# EAGLE design 6309 CPU Card v0 (EAGLE 4.16)
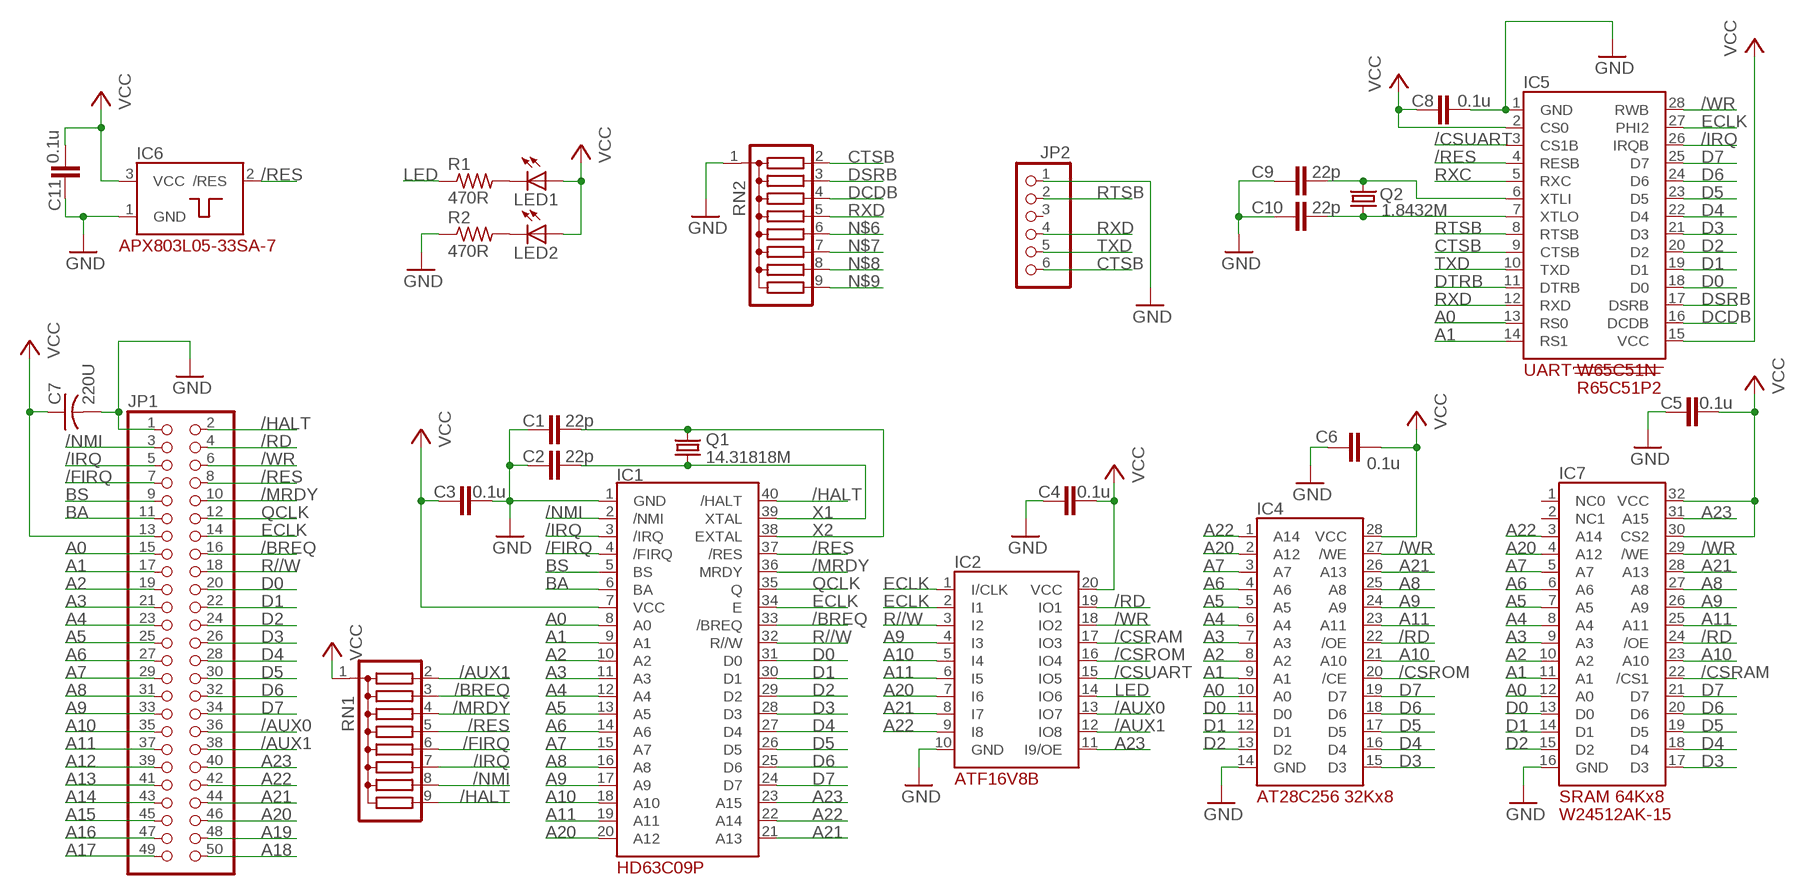
[diagram p0: schematic, sheet 1]

## Parts
C1  22p  C-EUC0603  [C0603]
C2  22p  C-EUC0603  [C0603]
C3  0.1u  C-EUC0603  [C0603]
C4  0.1u  C-EUC0603  [C0603]
C5  0.1u  C-EUC0603  [C0603]
C6  0.1u  C-EUC0603  [C0603]
C7  220U  C-US025-050X050  [C025-050X050]
C8  0.1u  C-EUC0603  [C0603]
C9  22p  C-EUC0603  [C0603]
C10  22p  C-EUC0603  [C0603]
C11  0.1u  C-EUC0603  [C0603]
IC1  HD63C09P  [DIL40]
IC2  PLD_ATF16V8B  [DIL20]
IC4  EEP_32KX8_AT28C256  [DIL28-6]
IC5  UART_W65C51N  [DIL28-6]
IC6  POR_APX803L05-33SA-7  [SOT23]
IC7  SRAM_64KX8_W24512AK-15  [DIL32-3]
JP1  PINHD-2X25  [2X25]
JP2  PINHD-1X6  [1X06]
LED1  LED3MM  [LED3MM]
LED2  LED3MM  [LED3MM]
Q1  14.31818M  CRYSTALHC49S  [HC49/S]
Q2  1.8432M  CRYSTALHC49U-H  [HC49U-H]
R1  470R  R-US_R0603  [R0603]
R2  470R  R-US_R0603  [R0603]
RN1  G08R  [SIL9]
RN2  G08R  [SIL9]

## Nets
/AUX0: IC2.13(IO7) JP1.36
/AUX1: IC2.12(IO8) JP1.38 RN1.2
/BREQ: IC1.33(/BREQ) JP1.16 RN1.3
/CSRAM: IC2.17(IO3) IC7.22(/CS1)
/CSROM: IC2.16(IO4) IC4.20(/CE)
/CSUART: IC2.15(IO5) IC5.3(CS1B)
/FIRQ: IC1.4(/FIRQ) JP1.7 RN1.6
/HALT: IC1.40(/HALT) JP1.2 RN1.9
/IRQ: IC1.3(/IRQ) IC5.26(IRQB) JP1.5 RN1.7
/MRDY: IC1.36(MRDY) JP1.10 RN1.4
/NMI: IC1.2(/NMI) JP1.3 RN1.8
/RD: IC2.19(IO1) IC4.22(/OE) IC7.24(/OE) JP1.4
/RES: IC1.37(/RES) IC5.4(RESB) IC6.2(/RES) JP1.8 RN1.5
/WR: IC2.18(IO2) IC4.27(/WE) IC5.28(RWB) IC7.29(/WE) JP1.6
A0: IC1.8(A0) IC4.10(A0) IC5.13(RS0) IC7.12(A0) JP1.15
A1: IC1.9(A1) IC4.9(A1) IC5.14(RS1) IC7.11(A1) JP1.17
A2: IC1.10(A2) IC4.8(A2) IC7.10(A2) JP1.19
A3: IC1.11(A3) IC4.7(A3) IC7.9(A3) JP1.21
A4: IC1.12(A4) IC4.6(A4) IC7.8(A4) JP1.23
A5: IC1.13(A5) IC4.5(A5) IC7.7(A5) JP1.25
A6: IC1.14(A6) IC4.4(A6) IC7.6(A6) JP1.27
A7: IC1.15(A7) IC4.3(A7) IC7.5(A7) JP1.29
A8: IC1.16(A8) IC4.25(A8) IC7.27(A8) JP1.31
A9: IC1.17(A9) IC2.4(I3) IC4.24(A9) IC7.26(A9) JP1.33
A10: IC1.18(A10) IC2.5(I4) IC4.21(A10) IC7.23(A10) JP1.35
A11: IC1.19(A11) IC2.6(I5) IC4.23(A11) IC7.25(A11) JP1.37
A12: JP1.39
A13: JP1.41
A14: JP1.43
A15: JP1.45
A16: JP1.47
A17: JP1.49
A18: JP1.50
A19: JP1.48
A20: IC1.20(A12) IC2.7(I6) IC4.2(A12) IC7.4(A12) JP1.46
A21: IC1.21(A13) IC2.8(I7) IC4.26(A13) IC7.28(A13) JP1.44
A22: IC1.22(A14) IC2.9(I8) IC4.1(A14) IC7.3(A14) JP1.42
A23: IC1.23(A15) IC2.11(I9/OE) IC7.31(A15) JP1.40
BA: IC1.6(BA) JP1.11
BS: IC1.5(BS) JP1.9
CTSB: IC5.9(CTSB) JP2.6 RN2.2
D0: IC1.31(D0) IC4.11(D0) IC5.18(D0) IC7.13(D0) JP1.20
D1: IC1.30(D1) IC4.12(D1) IC5.19(D1) IC7.14(D1) JP1.22
D2: IC1.29(D2) IC4.13(D2) IC5.20(D2) IC7.15(D2) JP1.24
D3: IC1.28(D3) IC4.15(D3) IC5.21(D3) IC7.17(D3) JP1.26
D4: IC1.27(D4) IC4.16(D4) IC5.22(D4) IC7.18(D4) JP1.28
D5: IC1.26(D5) IC4.17(D5) IC5.23(D5) IC7.19(D5) JP1.30
D6: IC1.25(D6) IC4.18(D6) IC5.24(D6) IC7.20(D6) JP1.32
D7: IC1.24(D7) IC4.19(D7) IC5.25(D7) IC7.21(D7) JP1.34
DCDB: IC5.16(DCDB) RN2.4
DSRB: IC5.17(DSRB) RN2.3
DTRB: IC5.11(DTRB)
ECLK: IC1.34(E) IC2.1(I/CLK) IC2.2(I1) IC5.27(PHI2) JP1.14
GND [supply]: C1.1 C2.1 C3.2 C4.1 C5.1 C6.1 C7.2 C8.2 C9.1 C10.1 C11.2 IC1.1(GND) IC2.10(GND) IC4.14(GND) IC5.1(GND) IC6.1(GND) IC7.16(GND) JP1.1 JP2.1 R2.1 RN2.1
LED: IC2.14(IO6) R1.1
N$1: LED1.K(C) R1.2
N$2: LED2.K(C) R2.2
N$6: RN2.6
N$7: RN2.7
N$8: RN2.8
N$9: RN2.9
N$20: C9.2 IC5.6(XTLI) Q2.2
N$21: C10.2 IC5.7(XTLO) Q2.1
QCLK: IC1.35(Q) JP1.12
R//W: IC1.32(R//W) IC2.3(I2) JP1.18
RTSB: IC5.8(RTSB) JP2.2
RXC: IC5.5(RXC)
RXD: IC5.12(RXD) JP2.4 RN2.5
TXD: IC5.10(TXD) JP2.5
VCC [supply]: C3.1 C4.2 C5.2 C6.2 C7.1 C8.1 C11.1 IC1.7(VCC) IC2.20(VCC) IC4.28(VCC) IC5.2(CS0) IC5.15(VCC) IC6.3(VCC) IC7.30(CS2) IC7.32(VCC) JP1.13 LED1.A LED2.A RN1.1
X1: C2.2 IC1.39(XTAL) Q1.1
X2: C1.2 IC1.38(EXTAL) Q1.2
Unconnected: IC7.1(NC0) IC7.2(NC1) JP2.3

## Notes on the sheet
- R65C51P2

## Library data of the parts
C1-C6 C8-C11 = rcl:C-EU: CAPACITOR, European symbol
C7 = rcl:C-US: CAPACITOR, American symbol
IC1 = 07-Retrocomputing:HD63C09P
IC2 = 07-Retrocomputing:PLD_ATF16V8B
IC4 = 07-Retrocomputing:EEP_32KX8_AT28C256
IC5 = 07-Retrocomputing:UART_W65C51N
IC6 = 07-Retrocomputing:POR_APX803L05-33SA-7
IC7 = 07-Retrocomputing:SRAM_64KX8_W24512AK-15
JP1 = pinhead:PINHD-2X25: PIN HEADER
JP2 = pinhead:PINHD-1X6: PIN HEADER
LED1 LED2 = led:LED: LED OSRAM: - CHIPLED LG R971, LG N971, LY N971, LG Q971, LY Q971, LO R971, LY R971 LH N974, LH R974 LS Q976, LO Q976, LY Q976 LO Q996 - Hyper CHIPLED LW Q18S LB Q993, LB Q99A, LB R99A - SideLED LS A670, LO A670, LY A670, LG A670, LP A670 LB A673, LV A673, LT A673, LW A673 LH A674 LY A675 LS A676, LA A676, LO A676, LY A676, LW A676 LS A679, LY A679, LG A679 - Hyper Micro SIDELED® LS Y876, LA Y876, LO Y876, LY Y876 LT Y87S - SmartLED LW L88C, LW L88S LB L89C, LB L89S, LG L890 LS L89K, LO L89K, LY L89K LS L896, LA L896, LO L896, LY L896 - TOPLED LS T670, LO T670, LY T670, LG T670, LP T670 LSG T670, LSP T670, LSY T670, LOP T670, LYG T670 LG T671, LOG T671, LSG T671 LB T673, LV T673, LT T673, LW T673 LH T674 LS T676, LA T676, LO T676, LY T676, LB T676, LH T676, LSB T676, LW T676 LB T67C, LV T67C, LT T67C, LS T67K, LO T67K, LY T67K, LW E67C LS E67B, LA E67B, LO E67B, LY E67B, LB E67C, LV E67C, LT E67C LW T67C LS T679, LY T679, LG T679 LS T770, LO T770, LY T770, LG T770, LP T770 LB T773, LV T773, LT T773, LW T773 LH T774 LS E675, LA E675, LY E675, LS T675 LS T776, LA T776, LO T776, LY T776, LB T776 LHGB T686 LT T68C, LB T68C - Hyper Mini TOPLED® LB M676 - Mini TOPLED Santana® LG M470 LS M47K, LO M47K, LY M47K Source: http://www.osram.convergy.de - LUMILED® LXK2-PW12-R00, LXK2-PW12-S00, LXK2-PW14-U00, LXK2-PW14-V00 LXK2-PM12-R00, LXK2-PM12-S00, LXK2-PM14-U00 LXK2-PE12-Q00, LXK2-PE12-R00, LXK2-PE12-S00, LXK2-PE14-T00, LXK2-PE14-U00 LXK2-PB12-K00, LXK2-PB12-L00, LXK2-PB12-M00, LXK2-PB14-N00, LXK2-PB14-P00, LXK2-PB14-Q00 LXK2-PR12-L00, LXK2-PR12-M00, LXK2-PR14-Q00, LXK2-PR14-R00 LXK2-PD12-Q00, LXK2-PD12-R00, LXK2-PD12-S00 LXK2-PH12-R00, LXK2-PH12-S00 LXK2-PL12-P00, LXK2-PL12-Q00, LXK2-PL12-R00 Source: www.luxeon.com
Q1 Q2 = crystal:CRYSTAL: CRYSTAL
R1 R2 = rcl:R-US_: RESISTOR, American symbol
RN1 RN2 = resistor-sil:G08R: SIL RESISTOR

## Net classes
0 default: width 0.203 mm, drill 0.203 mm, clearance 0.254 mm
1 supply: width 0.61 mm, drill 0.203 mm, clearance 0.305 mm

## Board
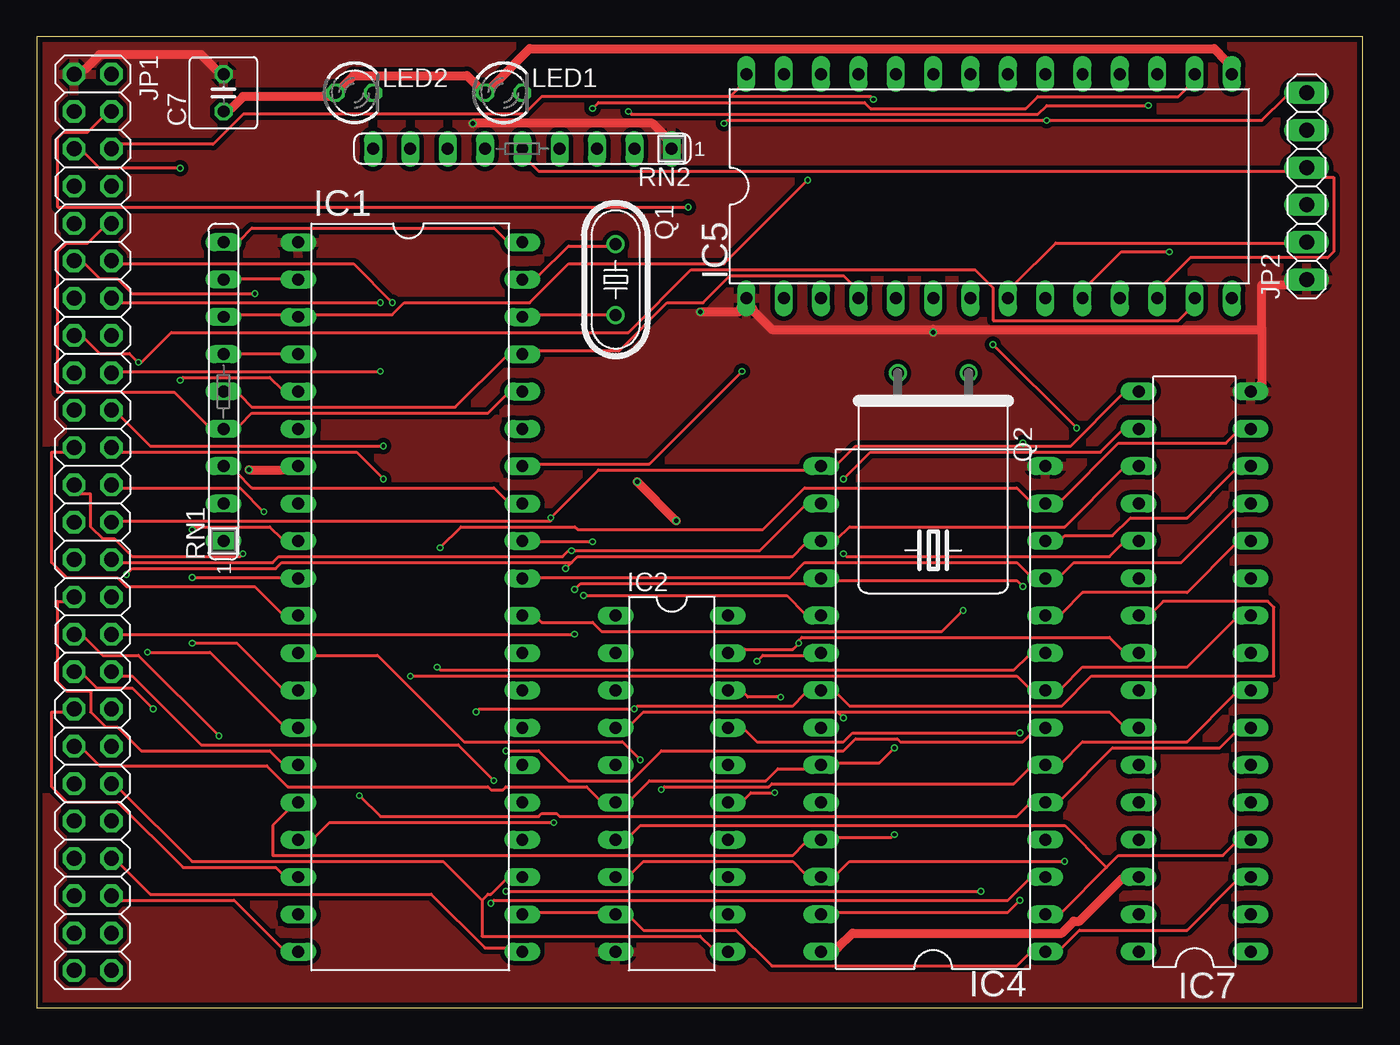
[diagram p1: board, top side]
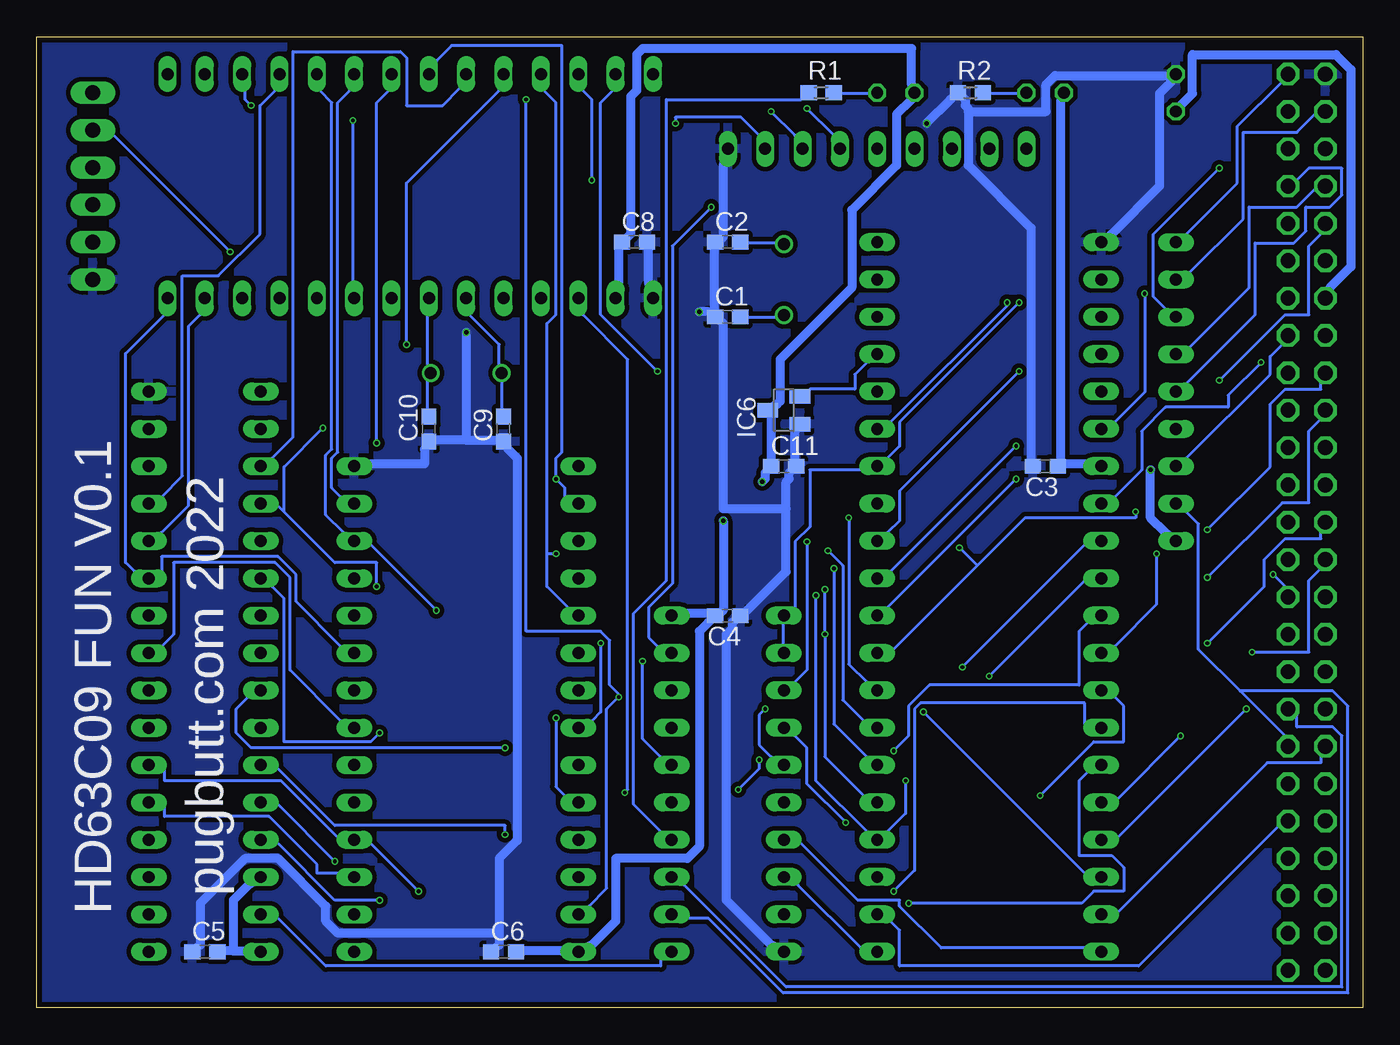
[diagram p2: board, bottom side, seen from below]

Size 90.17 x 66.04 mm. Coordinates in mm from the lower left corner, seen from the top.
Outline: 0,0 90.17,0 90.17,66.04 0,66.04 0,0
Copper layers (1*2*15*16): Top 0.0356mm / dielectric 0.1702mm / Route2 0.0178mm / dielectric 1.1938mm / Route15 0.0178mm / dielectric 0.1702mm / Bottom 0.0356mm
Design rules "oshpark-4layer": minimum track width 5mil, minimum drill 10mil, track to track 5mil, track to pad 5mil, pad to pad 5mil, via to via 5mil, smd to smd 5mil, copper to edge 15mil, drill to drill 6mil, minimum pad ring 4mil, minimum via ring 4mil, stop-mask expansion 2.5mil, vias tented up to drill 0mil, thermal gap 10mil

### Footprints (pad centres in the part's own frame; a part is rotated, then mirrored left to right if it is on the bottom)
C0603 = smd 1.1 x 1: 1 -0.85,0; 2 0.85,0
C025-050X050 = drill 0.813 octagon: 1 -1.27,0; 2 1.27,0
DIL40 = drill 0.813 long: 1 -24.13,-7.62; 2 -21.59,-7.62; 3 -19.05,-7.62; 4 -16.51,-7.62; 5 -13.97,-7.62; 6 -11.43,-7.62; 7 -8.89,-7.62; 8 -6.35,-7.62; 9 -3.81,-7.62; 10 -1.27,-7.62; 11 1.27,-7.62; 12 3.81,-7.62; 13 6.35,-7.62; 14 8.89,-7.62; 15 11.43,-7.62; 16 13.97,-7.62; 17 16.51,-7.62; 18 19.05,-7.62; 19 21.59,-7.62; 20 24.13,-7.62; 21 24.13,7.62; 22 21.59,7.62; 23 19.05,7.62; 24 16.51,7.62; 25 13.97,7.62; 26 11.43,7.62; 27 8.89,7.62; 28 6.35,7.62; 29 3.81,7.62; 30 1.27,7.62; 31 -1.27,7.62; 32 -3.81,7.62; 33 -6.35,7.62; 34 -8.89,7.62; 35 -11.43,7.62; 36 -13.97,7.62; 37 -16.51,7.62; 38 -19.05,7.62; 39 -21.59,7.62; 40 -24.13,7.62
DIL20 = drill 0.813 long: 1 -11.43,-3.81; 2 -8.89,-3.81; 3 -6.35,-3.81; 4 -3.81,-3.81; 5 -1.27,-3.81; 6 1.27,-3.81; 7 3.81,-3.81; 8 6.35,-3.81; 9 8.89,-3.81; 10 11.43,-3.81; 11 11.43,3.81; 12 8.89,3.81; 13 6.35,3.81; 14 3.81,3.81; 15 1.27,3.81; 16 -1.27,3.81; 17 -3.81,3.81; 18 -6.35,3.81; 19 -8.89,3.81; 20 -11.43,3.81
DIL28-6 = drill 0.813 long: 1 -16.51,-7.62; 2 -13.97,-7.62; 3 -11.43,-7.62; 4 -8.89,-7.62; 5 -6.35,-7.62; 6 -3.81,-7.62; 7 -1.27,-7.62; 8 1.27,-7.62; 9 3.81,-7.62; 10 6.35,-7.62; 11 8.89,-7.62; 12 11.43,-7.62; 13 13.97,-7.62; 14 16.51,-7.62; 15 16.51,7.62; 16 13.97,7.62; 17 11.43,7.62; 18 8.89,7.62; 19 6.35,7.62; 20 3.81,7.62; 21 1.27,7.62; 22 -1.27,7.62; 23 -3.81,7.62; 24 -6.35,7.62; 25 -8.89,7.62; 26 -11.43,7.62; 27 -13.97,7.62; 28 -16.51,7.62
SOT23 = smd 1 x 1.4: 1 -0.95,-1.1; 2 0.95,-1.1; 3 0,1.1
DIL32-3 = drill 0.813 long: 1 -19.05,-3.81; 2 -16.51,-3.81; 3 -13.97,-3.81; 4 -11.43,-3.81; 5 -8.89,-3.81; 6 -6.35,-3.81; 7 -3.81,-3.81; 8 -1.27,-3.81; 9 1.27,-3.81; 10 3.81,-3.81; 11 6.35,-3.81; 12 8.89,-3.81; 13 11.43,-3.81; 14 13.97,-3.81; 15 16.51,-3.81; 16 19.05,-3.81; 17 19.05,3.81; 18 16.51,3.81; 19 13.97,3.81; 20 11.43,3.81; 21 8.89,3.81; 22 6.35,3.81; 23 3.81,3.81; 24 1.27,3.81; 25 -1.27,3.81; 26 -3.81,3.81; 27 -6.35,3.81; 28 -8.89,3.81; 29 -11.43,3.81; 30 -13.97,3.81; 31 -16.51,3.81; 32 -19.05,3.81
2X25 = drill 1.016 octagon: 1 -30.48,-1.27; 2 -30.48,1.27; 3 -27.94,-1.27; 4 -27.94,1.27; 5 -25.4,-1.27; 6 -25.4,1.27; 7 -22.86,-1.27; 8 -22.86,1.27; 9 -20.32,-1.27; 10 -20.32,1.27; 11 -17.78,-1.27; 12 -17.78,1.27; 13 -15.24,-1.27; 14 -15.24,1.27; 15 -12.7,-1.27; 16 -12.7,1.27; 17 -10.16,-1.27; 18 -10.16,1.27; 19 -7.62,-1.27; 20 -7.62,1.27; 21 -5.08,-1.27; 22 -5.08,1.27; 23 -2.54,-1.27; 24 -2.54,1.27; 25 0,-1.27; 26 0,1.27; 27 2.54,-1.27; 28 2.54,1.27; 29 5.08,-1.27; 30 5.08,1.27; 31 7.62,-1.27; 32 7.62,1.27; 33 10.16,-1.27; 34 10.16,1.27; 35 12.7,-1.27; 36 12.7,1.27; 37 15.24,-1.27; 38 15.24,1.27; 39 17.78,-1.27; 40 17.78,1.27; 41 20.32,-1.27; 42 20.32,1.27; 43 22.86,-1.27; 44 22.86,1.27; 45 25.4,-1.27; 46 25.4,1.27; 47 27.94,-1.27; 48 27.94,1.27; 49 30.48,-1.27; 50 30.48,1.27
1X06 = drill 1.016 long: 1 -6.35,0; 2 -3.81,0; 3 -1.27,0; 4 1.27,0; 5 3.81,0; 6 6.35,0
LED3MM = drill 0.813 octagon: A -1.27,0; K 1.27,0
HC49/S = drill 0.813 round: 1 -2.413,0; 2 2.413,0
HC49U-H = drill 0.813 round: 1 -2.413,-5.08; 2 2.413,-5.08
R0603 = smd 1.1 x 1: 1 -0.85,0; 2 0.85,0
SIL9 = drill 0.813 long: 1 -10.16,0; 2 -7.62,0; 3 -5.08,0; 4 -2.54,0; 5 0,0; 6 2.54,0; 7 5.08,0; 8 7.62,0; 9 10.16,0

### Placement (x,y rotation side)
C1  43.18,46.99 0 bottom
C2  43.18,52.07 0 bottom
C3  21.59,36.83 180 bottom
C4  43.18,26.67 180 bottom
C5  78.74,3.81 0 bottom
C6  58.42,3.81 0 bottom
C7  12.7,62.23 90 top
C8  49.53,52.07 0 bottom
C9  58.42,39.37 90 bottom
C10  63.5,39.37 90 bottom
C11  39.37,36.83 0 bottom
IC1  25.4,27.94 270 top
IC2  43.18,15.24 270 top
IC4  60.96,20.32 90 top
IC5  64.77,55.88 0 top
IC6  39.37,40.64 90 bottom
IC7  78.74,22.86 90 top
JP1  3.81,33.02 270 top
JP2  86.36,55.88 90 top
LED1  31.75,62.23 0 top
LED2  21.59,62.23 0 top
Q1  39.37,49.53 270 top
Q2  60.96,38.1 180 top
R1  36.83,62.23 0 bottom
R2  26.67,62.23 0 bottom
RN1  12.7,41.91 90 top
RN2  33.02,58.42 180 top

### Tracks (layer width: path | path; a pad name or v marks a point on that pad's centre or on a via)
/AUX0
  Bottom 0.203: IC2.13 46.13,8.33 39.22,1.42 1.42,1.42 1.42,18.49 2.03,19.1 4.47,19.1 4.47,19.91 JP1.36
/AUX1
  Bottom 0.203: 8.33,21.54 5.28,18.49 JP1.38 | 8.33,21.54 11.18,24.38 11.18,32.92 11.99,33.73 RN1.2 | 8.33,21.54 2.03,21.54 1.02,20.52 1.02,1.02 39.42,1.02 44.5,6.1 45.92,6.1 IC2.12
/BREQ
  Top 0.203: IC1.33 31.9,34.54 31.09,35.36 14.63,35.36 13.61,36.37 RN1.3
  Bottom 0.203: RN1.3 11.99,37.39 6.3,43.08 6.3,44.3 5.49,45.11 JP1.16
/CSRAM  (via drill 0.25)
  Top 0.203: v66.85,18.69 55.47,18.69 54.86,18.09 48.97,18.09 48.16,18.9 IC2.17
  Bottom 0.203: v66.85,18.69 67.46,18.09 73.36,18.09 73.36,27.84 74.17,28.65 IC7.22
/CSROM  (via drill 0.25)
  Top 0.203: v48.97,23.57 49.38,23.98 52.22,23.98 IC4.20
  Bottom 0.203: v48.97,23.57 48.97,18.29 47.75,17.07 IC2.16
/CSUART  (via drill 0.25)
  Top 0.203: v50.19,14.63 48.56,14.63 48.16,14.22 IC2.15
  Bottom 0.203: v50.19,14.63 49.99,14.83 49.99,44.09 53.03,47.14 IC5.3
/FIRQ
  Top 0.203: RN1.6 13.82,44.5 16.66,44.5 IC1.4
  Bottom 0.203: JP1.7 3.25,55.68 4.47,54.46 7.72,54.46 7.72,48.97 11.79,44.91 RN1.6
/HALT
  Top 0.203: IC1.40 31.9,52.22 31.09,53.03 14.63,53.03 13.82,52.22 RN1.9
  Bottom 0.203: RN1.9 11.99,52.63 8.53,56.08 8.53,59.94 5.49,62.99 JP1.2
/IRQ  (via drill 0.25)
  Top 0.203: RN1.7 13.82,47.14 16.66,47.14 IC1.3 18.9,47.14 24.18,47.14 24.99,47.95 33.53,47.95 36.17,50.6 46.74,50.6 v52.43,56.29 | v9.75,57.1 4.27,57.1 3.25,58.12 JP1.5
  Bottom 0.203: v52.43,56.29 52.43,61.77 53.03,62.38 IC5.26 | v9.75,57.1 14.22,52.63 14.22,48.36 13.41,47.55 RN1.7
/MRDY
  Top 0.203: IC1.36 31.9,41.66 30.68,40.44 14.63,40.44 13.82,39.62 RN1.4 11.58,39.62 9.35,41.86 1.42,41.86 1.42,51.41 2.03,52.02 3.45,52.02 4.47,53.03 JP1.10
/NMI
  Top 0.203: RN1.8 13.82,49.58 16.66,49.58 IC1.2
  Bottom 0.203: JP1.3 3.25,60.76 4.47,59.54 8.13,59.54 8.13,53.65 11.79,49.99 RN1.8
/RD  (via drill 0.25)
  Top 0.203: IC2.19 48.16,24.38 51.41,24.38 v51.82,24.79 51.82,24.99 52.02,25.2 72.95,25.2 73.76,24.38 IC7.24 | v44.3,54.46 1.42,54.46 1.42,59.13 1.83,59.54 3.45,59.54 4.47,60.55 JP1.4
  Bottom 0.203: v51.82,24.79 51.82,20.12 52.43,19.51 IC4.22 | v44.3,54.46 46.94,51.82 46.94,28.85 48.56,27.23 48.56,25.2 47.95,24.59 IC2.19
/RES
  Top 0.203: RN1.5 13.82,41.66 14.63,40.84 28.45,40.84 31.9,44.3 IC1.37 34.14,44.7 39.62,44.7 42.88,47.95 45.31,47.95 47.14,49.78 54.86,49.78 55.47,49.17 IC5.4
  Bottom 0.203: IC6.2 37.59,42.06 34.54,42.06 34.54,43.08 33.73,43.89 IC1.37 | JP1.8 4.47,56.29 3.66,57.1 1.42,57.1 1.42,55.27 2.23,54.46 3.86,54.46 3.86,52.83 4.67,52.02 7.32,52.02 7.32,47.14 11.99,42.47 RN1.5
/WR  (via drill 0.25)
  Top 0.203: v50.6,21.13 48.36,21.13 48.16,21.34 IC2.18 | v66.85,7.32 66.04,6.5 54.46,6.5 IC4.27 | 47.14,61.98 47.75,62.59 IC5.28 | 47.14,61.98 34.34,61.98 33.12,60.76 14.02,60.76 11.99,58.73 5.69,58.73 JP1.6 | v56.9,61.77 56.69,61.98 47.14,61.98
  Bottom 0.203: IC4.27 52.63,6.91 51.41,8.13 51.41,20.32 v50.6,21.13 50.6,21.34 51.21,21.95 51.21,24.99 51.82,25.6 56.9,25.6 v56.9,61.77 | v66.85,7.32 69.9,7.32 73.76,11.18 IC7.29
A0  (via drill 0.25)
  Top 0.203: JP1.15 3.25,45.52 4.27,44.5 6.3,44.5 v6.91,43.89 7.11,43.89 9.14,45.92 40.23,45.92 44.5,50.19 63.8,50.19 65.02,48.97 65.02,46.74 77.62,46.74 78.23,47.35 IC5.13 | IC4.10 69.7,26.82 71.12,28.25 78.23,28.25 81.48,31.5 IC7.12
  Bottom 0.203: v6.91,43.89 9.14,41.66 9.14,40.84 13.41,40.84 15.04,39.22 15.04,36.58 16.87,34.75 IC1.8 | IC5.13 79.05,47.14 79.86,46.33 79.86,34.14 81.69,32.31 IC7.12
A1  (via drill 0.25)
  Top 0.203: v10.57,32.51 10.77,32.72 15.85,32.72 16.66,31.9 IC1.9 | v27.23,23.16 27.43,22.96 66.45,22.96 67.46,23.98 IC4.9
  Bottom 0.203: v10.57,32.51 6.3,36.78 6.3,41.05 5.28,42.06 2.85,42.06 2.85,42.47 JP1.17 | IC4.9 69.49,24.59 72.54,27.64 72.54,29.46 73.76,30.68 81.69,30.68 81.69,29.67 IC7.11 83.52,29.67 84.12,30.28 84.12,44.5 81.48,47.14 IC5.14 | v27.23,23.16 18.9,31.5 IC1.9
A2  (via drill 0.25)
  Top 0.203: IC7.10 81.48,26.42 78.23,23.16 71.12,23.16 69.7,21.74 IC4.8 67.46,21.74 66.65,22.55 v25.4,22.55 | v10.57,29.26 16.66,29.26 IC1.10
  Bottom 0.203: v10.57,29.26 5.49,34.34 3.66,34.34 3.66,39.22 2.85,40.03 JP1.19 | v25.4,22.55 18.9,29.06 IC1.10
A3  (via drill 0.25)
  Top 0.203: IC1.11 16.66,26.82 14.83,28.65 6.1,28.65 5.49,29.26 2.03,29.26 1.02,30.28 1.02,37.8 1.83,37.8 JP1.21 | v31.9,17.48 34.14,17.48 36.17,15.44 40.44,15.44 42.47,17.48 54.86,17.48 55.68,18.29 58.52,18.29 58.73,18.09 67.06,18.09 67.67,18.69 IC4.7
  Bottom 0.203: IC4.7 69.49,19.51 72.95,22.96 72.95,29.26 73.97,30.28 80.87,30.28 80.87,25.4 81.69,24.59 IC7.9 | v31.9,17.48 30.89,18.49 30.89,20.52 29.46,21.95 19.3,21.95 19.3,25.6 18.69,26.21 IC1.11
A4  (via drill 0.25)
  Top 0.203: IC7.8 81.48,21.34 78.23,18.09 71.12,18.09 69.7,16.66 IC4.6 67.46,16.26 66.45,15.24 49.99,15.24 49.78,15.04 42.67,15.04 v42.47,14.83 | v14.02,30.89 13.82,30.68 6.5,30.68 5.28,31.9 4.47,31.9 3.66,32.72 3.66,34.95 2.85,34.95 JP1.23 | v41.05,16.87 39.83,18.09 29.06,18.09 23.16,23.98 18.9,23.98 IC1.12
  Bottom 0.203: v14.02,30.89 14.02,27.43 16.87,24.59 IC1.12 | v42.47,14.83 41.05,16.26 v41.05,16.87
A5  (via drill 0.25)
  Top 0.203: IC7.7 81.48,18.69 80.47,17.68 73.15,17.68 69.7,14.22 IC4.5 67.46,13.82 66.65,13.01 35.56,13.01 35.36,13.21 34.34,13.21 34.14,13.01 23.37,13.01 v21.95,14.43 | v10.57,24.79 13.61,24.79 16.66,21.74 IC1.13
  Bottom 0.203: v10.57,24.79 6.71,28.65 6.71,30.48 5.28,31.9 2.85,31.9 2.85,32.31 JP1.25 | v21.95,14.43 18.29,18.09 16.26,18.09 16.26,20.52 16.87,21.13 IC1.13
A6  (via drill 0.25)
  Top 0.203: v7.52,24.18 11.79,24.18 16.66,19.3 IC1.14 | v31.9,7.92 v64.21,7.92
  Bottom 0.203: IC7.6 81.48,16.26 81.48,15.44 73.56,15.44 69.7,11.58 IC4.4 67.46,11.18 v64.21,7.92 | v7.52,24.18 3.66,24.18 3.66,29.06 2.85,29.87 JP1.27 | v31.9,7.92 30.48,9.35 30.48,20.32 30.07,20.73 18.9,20.73 18.9,19.3 IC1.14
A7  (via drill 0.25)
  Top 0.203: IC1.15 16.66,16.66 15.85,17.48 7.11,17.48 5.49,19.1 4.67,19.1 3.66,20.12 3.66,21.54 2.03,21.54 1.42,22.15 1.42,27.64 1.83,27.64 JP1.29 | v30.89,7.11 31.09,7.32 66.04,7.32 67.46,8.74 IC4.3
  Bottom 0.203: IC4.3 69.7,9.14 71.12,9.14 71.12,9.75 74.37,13.01 81.48,13.01 81.48,13.61 IC7.5 | v30.89,7.11 19.1,7.11 18.29,7.92 16.26,7.92 16.26,9.55 17.07,10.36 19.3,10.36 19.3,15.44 18.69,16.05 IC1.15
A8  (via drill 0.25)
  Top 0.203: IC1.16 17.07,13.41 16.05,12.39 16.05,10.36 51.41,10.36 52.22,11.18 IC4.25 54.46,11.58 58.12,11.58 v58.32,11.79 | v12.39,18.49 6.91,23.98 4.47,23.98 3.25,25.2 JP1.31
  Bottom 0.203: v58.32,11.79 58.32,12.39 69.9,12.39 73.76,16.26 IC7.27 | v12.39,18.49 16.66,14.22 IC1.16
A9  (via drill 0.25)
  Top 0.203: v7.92,20.32 6.5,21.74 4.06,21.74 3.25,22.55 JP1.33 | 54.46,20.12 v54.86,19.71 | 54.46,20.12 41.25,20.12 40.44,19.3 IC2.4 | 54.46,20.12 72.95,20.12 73.76,19.3 IC7.26 | v35.15,12.6 19.91,12.6 18.9,11.58 IC1.17
  Bottom 0.203: v7.92,20.32 16.66,11.58 IC1.17 | v54.86,19.71 54.86,15.04 54.25,14.43 IC4.24 | v35.15,12.6 37.8,15.24 37.8,17.68 38.61,18.49 IC2.4
A10  (via drill 0.25)
  Top 0.203: IC1.18 16.66,9.14 16.26,9.55 9.96,9.55 5.49,14.02 2.03,14.02 1.02,15.04 1.02,20.12 1.83,20.12 JP1.35 | IC7.23 76,27.03 76.61,27.64 83.72,27.64 84.12,27.23 84.12,22.55 71.73,22.55 69.7,20.52 55.27,20.52 54.46,21.34 IC4.21 52.22,21.34 51.41,20.52 40.84,20.52 v40.64,20.32 30.07,20.32 v29.87,20.12
  Bottom 0.203: v40.64,20.32 41.05,19.91 41.05,17.88 40.23,17.07 IC2.5 | v29.87,20.12 18.9,9.14 IC1.18
A11  (via drill 0.25)
  Top 0.203: v58.32,17.68 57.3,16.66 54.46,16.66 IC4.23 52.22,16.26 50.39,16.26 49.58,15.44 41.66,15.44 40.44,14.22 IC2.6 38.2,14.22 37.39,15.04 31.9,15.04 31.7,14.83 30.89,14.83 30.68,15.04 17.07,15.04 15.65,16.46 4.27,16.46 3.25,17.48 JP1.37
  Bottom 0.203: IC1.19 16.66,6.5 6.5,16.66 2.85,16.66 2.85,17.07 JP1.37 | v58.32,17.68 75.59,17.68 76.61,18.69 76.61,20.32 75.79,21.13 IC7.25
A20
  Top 0.203: 72.75,9.55 73.56,10.36 80.67,10.36 81.48,11.18 IC7.4 | 72.75,9.55 69.7,6.5 IC4.2 | IC1.20 16.66,4.06 13.41,7.32 5.69,7.32 JP1.46 | 72.75,9.55 69.9,12.39 41.05,12.39 40.44,11.79 IC2.7
  Bottom 0.203: IC2.7 38.2,11.18 34.34,7.32 31.5,7.32 31.5,6.91 28.65,4.06 18.9,4.06 IC1.20
A21  (via drill 0.25)
  Top 0.203: IC2.8 40.44,9.14 41.25,9.96 51.41,9.96 52.22,9.14 IC4.26 54.46,9.14 55.27,9.96 v69.9,9.96 | JP1.44 5.69,9.75 7.72,7.72 26.82,7.72 30.48,4.06 31.9,4.06 IC1.21
  Bottom 0.203: IC1.21 34.14,4.06 38.41,8.33 38.41,8.53 IC2.8 | v69.9,9.96 73.76,13.82 IC7.28
A22
  Top 0.203: IC7.3 81.48,8.53 78.23,5.28 70.92,5.28 69.7,4.06 IC4.1 67.46,3.66 66.65,2.85 49.99,2.85 47.55,5.28 41.25,5.28 40.44,6.1 IC2.9 38.2,6.5 34.14,6.5 IC1.22
  Bottom 0.203: JP1.42 5.69,12.39 15.24,2.85 31.5,2.85 31.5,5.28 32.11,5.89 IC1.22
A23
  Top 0.203: 30.28,7.32 30.68,7.72 30.89,7.72 31.9,8.74 IC1.23 | 30.28,7.32 30.28,4.88 45.11,4.88 45.92,4.06 IC2.11 | 30.28,7.32 27.64,9.96 10.57,9.96 5.69,14.83 JP1.40
  Bottom 0.203: IC7.31 73.76,6.1 70.51,2.85 47.75,2.85 47.75,3.25 IC2.11
BA  (via drill 0.25)
  Top 0.203: v14.83,48.56 6.5,48.56 5.49,49.58 4.27,49.58 3.25,50.6 JP1.11
  Bottom 0.203: v14.83,48.56 14.83,41.86 16.87,39.83 IC1.6
BS  (via drill 0.25)
  Top 0.203: v9.75,42.67 9.96,42.88 15.85,42.88 16.66,42.06 IC1.5
  Bottom 0.203: v9.75,42.67 5.28,47.14 3.66,47.14 3.66,51.82 2.85,52.63 JP1.9
CTSB  (via drill 0.25)
  Top 0.203: v46.74,60.15 46.94,60.35 v68.68,60.35 83.31,60.35 84.94,61.98 JP2.6
  Bottom 0.203: v46.74,60.15 46.74,60.55 42.27,60.55 41.05,59.33 RN2.2 | v68.68,60.35 68.68,49.38 IC5.9
D0  (via drill 0.25)
  Top 0.203: IC1.31 34.14,29.26 51.21,29.26 52.22,30.28 66.65,30.28 67.46,29.46 IC4.11 69.7,29.46 70.51,30.28 77.83,30.28 81.48,33.93 IC7.13 | v23.57,38.2 7.72,38.2 5.69,40.23 JP1.20
  Bottom 0.203: IC5.18 73.97,62.38 74.98,61.37 74.98,52.63 77.83,49.78 80.26,49.78 80.26,36.17 81.69,34.75 IC7.13 | v23.57,38.2 32.11,29.67 IC1.31
D1  (via drill 0.25)
  Top 0.203: v23.57,35.97 21.74,37.8 5.69,37.8 JP1.22 | IC4.12 69.7,31.9 69.9,32.11 73.15,32.11 74.37,33.33 78.23,33.33 81.48,36.58 IC7.14 | v62.99,27.03 61.57,25.6 38.41,25.6 37.8,26.21 34.34,26.21 34.14,26.42 IC1.30
  Bottom 0.203: v23.57,35.97 32.31,27.23 IC1.30 | IC5.19 70.92,62.38 70.1,61.57 70.1,38 70.51,37.59 70.51,33.53 69.29,32.31 IC4.12 67.46,31.5 v62.99,27.03
D2  (via drill 0.25)
  Top 0.203: v15.44,33.73 13.82,35.36 5.69,35.36 JP1.24 | IC7.15 81.48,39.01 80.87,38.41 73.56,38.41 69.7,34.54 IC4.13 67.46,34.54 66.65,35.36 52.22,35.36 49.38,32.51 36.78,32.51 36.58,32.72 28.85,32.72 v27.43,31.29
  Bottom 0.203: 26.21,30.07 22.96,33.33 15.44,33.33 v15.44,33.73 | 26.21,30.07 31.9,24.38 IC1.29 | IC5.20 68.89,62.38 69.7,61.57 69.7,37.8 70.1,37.39 70.1,35.36 69.49,34.75 IC4.13 | 26.21,30.07 v27.43,31.29
D3  (via drill 0.25)
  Top 0.203: 67.06,38.2 55.68,38.2 54.46,36.98 IC4.15 52.22,36.58 38.2,36.58 v34.95,33.33 34.95,33.12 5.69,33.12 JP1.26 | 67.06,38.2 70.31,38.2 73.76,41.66 IC7.17 | 67.06,38.2 v67.06,38.41
  Bottom 0.203: v34.95,33.33 34.95,23.37 33.73,22.15 IC1.28 | v67.06,38.41 67.06,61.57 66.24,62.38 IC5.21
D4  (via drill 0.25)
  Top 0.203: IC4.16 52.22,34.14 49.17,31.09 v36.37,31.09 36.17,31.09 35.76,30.68 16.46,30.68 16.05,30.28 5.69,30.28 JP1.28 | v54.86,35.97 56.69,37.8 72.34,37.8 73.76,39.22 IC7.18
  Bottom 0.203: v36.37,31.09 35.36,30.07 35.36,20.93 33.93,19.51 IC1.27 | IC4.16 54.25,34.75 54.25,35.36 v54.86,35.97 54.86,37.39 54.46,37.8 54.46,65.43 61.98,65.43 62.99,64.41 IC5.22
D5  (via drill 0.25)
  Top 0.203: 36.37,30.28 36.78,30.68 51.41,30.68 52.22,31.5 IC4.17 54.46,31.9 55.27,32.72 69.9,32.72 73.76,36.58 IC7.19 | 36.37,30.28 v35.97,29.87 | v6.1,29.46 6.5,29.87 16.26,29.87 16.66,30.28 36.37,30.28
  Bottom 0.203: v35.97,29.87 35.97,19.3 33.73,17.07 IC1.26 | IC5.23 61.37,62.59 62.59,61.37 65.02,61.37 65.02,64.62 65.43,65.02 72.75,65.02 72.75,38.81 74.17,37.39 IC7.19 | v6.1,29.46 5.28,28.65 JP1.30
D6  (via drill 0.25)
  Top 0.203: v36.58,28.45 36.98,28.85 52.43,28.85 IC4.18 54.46,29.06 66.65,29.06 v67.06,28.65 | v70.71,39.42 v65.02,45.11 | JP1.32 v36.58,25.4
  Bottom 0.203: v36.58,28.45 v36.58,25.4 36.58,17.07 33.93,14.43 IC1.25 | 73.36,33.73 69.9,30.28 67.06,30.28 v67.06,28.65 | 73.36,33.73 73.76,34.14 IC7.20 | v65.02,45.11 65.02,56.08 58.73,62.38 IC5.24 | v70.71,39.42 73.36,36.78 73.36,33.73
D7  (via drill 0.25)
  Top 0.203: v31.09,15.44 28.65,17.88 11.18,17.88 6.5,22.55 5.69,22.55 JP1.34 | v54.86,30.89 55.07,30.68 72.95,30.68 73.76,31.5 IC7.21 | v37.19,28.04 51,28.04 52.22,26.82 IC4.19
  Bottom 0.203: v31.09,15.44 31.09,13.21 32.31,11.99 IC1.24 33.73,11.99 37.19,15.44 v37.19,28.04 | 55.47,30.89 55.47,46.53 54.86,47.14 54.86,61.57 55.68,62.38 IC5.25 | 55.47,30.89 55.47,28.65 54.05,27.23 IC4.19 | 55.47,30.89 v54.86,30.89
DCDB  (via drill 0.25)
  Top 0.203: v37.8,61.16 38.2,61.57 56.29,61.57 56.69,61.16 67.26,61.16 68.07,61.98 77.62,61.98 78.23,62.59 IC5.16
  Bottom 0.203: v37.8,61.16 35.97,59.33 RN2.4
DSRB  (via drill 0.25)
  Top 0.203: v40.23,60.96 40.44,60.76 68.07,60.76 68.68,61.37 v75.59,61.37
  Bottom 0.203: v40.23,60.96 38.61,59.33 RN2.3 | v75.59,61.37 76,61.77 76,62.38 IC5.17
ECLK  (via drill 0.25)
  Top 0.203: v47.95,43.28 41.66,36.98 34.14,36.98 IC1.34 | v23.37,47.95 5.69,47.95 JP1.14
  Bottom 0.203: IC2.2 39.42,24.59 39.42,26.21 IC2.1 38.61,27.23 38.61,31.7 37.59,32.72 37.59,36.58 34.14,36.58 IC1.34 32.31,37.39 31.5,38.2 31.5,39.83 v23.37,47.95 | v47.95,43.28 51.82,47.14 51.82,61.57 51,62.38 IC5.27
GND  (via drill 0.3)
  Top 0.61: JP1.1 3.25,63.8 4.27,64.82 11.18,64.82 12.19,63.8 C7.2 | 83.31,46.13 83.31,49.17 84.94,49.17 JP2.1 | 83.31,46.13 83.31,42.47 IC7.16 | v45.11,47.35 47.75,47.35 IC5.1 48.77,47.35 49.99,46.13 60.96,46.13 | 60.96,46.13 83.31,46.13 | v29.67,60.15 41.86,60.15 42.67,59.33 RN2.1 | 60.96,46.13 v60.96,45.92
  Bottom 0.61: 58.73,5.08 58.73,10.16 57.51,11.38 57.51,37.39 58.12,38 C9.1 58.73,38.61 60.96,38.61 | 58.73,5.08 58.73,4.27 C6.1 | C5.1 79.05,4.27 79.05,7.11 76,10.16 73.76,10.16 70.51,6.91 70.51,5.89 69.7,5.08 58.73,5.08 | 60.96,38.61 63.2,38.61 C10.1 63.8,38 63.8,36.98 67.46,36.98 IC4.14 | 26.82,60.96 26.82,61.16 27.03,61.37 27.03,61.77 R2.1 28.04,61.77 v29.67,60.15 | 26.82,60.96 26.82,57.3 22.55,53.03 22.55,37.19 C3.2 | IC1.1 17.07,52.63 13.82,55.88 13.82,62.18 13.01,62.99 C7.2 13.21,63.4 20.93,63.4 21.54,62.79 21.54,60.96 26.82,60.96 | IC6.1 38.61,39.22 38.61,37.19 C11.2 39.01,36.37 39.01,35.97 39.22,35.76 39.22,33.93 | 39.22,33.93 39.22,29.67 41.86,27.03 C4.1 42.88,26.21 42.88,25.81 43.28,25.4 43.28,7.32 40.23,4.27 IC2.10 | C8.2 48.56,51.61 48.56,49.38 IC5.1 | C1.1 44.09,47.35 44.09,51.61 C2.1 43.48,52.43 43.48,57.3 RN2.1 | v45.11,47.35 44.5,47.35 C1.1 | 39.22,33.93 43.48,33.93 43.48,46.53 C1.1 | v60.96,45.92 60.96,38.61
  pour Bottom: 0,66.04 90.17,66.04 90.17,0 0,0
  pour Top: 0,66.04 90.17,66.04 90.17,0 0,0
LED
  Bottom 0.203: R1.1 38.2,61.77 47.35,61.77 47.35,29.06 49.58,26.82 49.58,13.82 47.75,11.99 IC2.14
N$1
  Bottom 0.203: R1.2 35.56,62.18 33.53,62.18 LED1.K
N$2
  Bottom 0.203: R2.2 25.4,62.18 23.37,62.18 LED2.K
N$20
  Bottom 0.203: C9.2 58.52,40.64 58.52,42.67 Q2.2 58.73,43.69 58.73,45.11 60.76,47.14 IC5.6
N$21
  Bottom 0.203: C10.2 63.6,40.64 63.6,42.67 Q2.1 63.6,43.69 63.6,47.14 IC5.7
QCLK  (via drill 0.25)
  Top 0.203: v24.18,47.95 21.54,50.6 5.69,50.6 JP1.12
  Bottom 0.203: v24.18,47.95 24.18,47.75 32.11,39.83 IC1.35
R//W  (via drill 0.25)
  Top 0.203: v37.8,31.7 34.14,31.7 IC1.32 | v23.37,43.28 5.69,43.28 JP1.18
  Bottom 0.203: v37.8,31.7 37.8,22.96 38.61,22.15 IC2.3 | v23.37,43.28 31.5,35.15 31.5,33.12 32.31,32.31 IC1.32
RTSB
  Top 0.203: IC5.8 66.45,49.17 69.29,52.02 84.94,52.02 JP2.2
RXD
  Top 0.203: RN2.5 33.53,57.51 34.14,56.9 84.94,56.9 JP2.4 87.38,56.49 88.19,56.49 88.19,51.41 87.78,51 78.44,51 76.61,49.17 IC5.12
TXD  (via drill 0.25)
  Top 0.203: v77.01,51.41 73.76,51.41 71.53,49.17 IC5.10
  Bottom 0.203: v77.01,51.41 84.94,59.33 JP2.5
VCC  (via drill 0.3)
  Top 0.61: IC7.30 73.76,8.74 70.92,5.89 70.51,5.89 69.7,5.08 55.47,5.08 54.46,4.06 IC4.28 | v14.43,36.58 16.66,36.58 IC1.7 | C7.1 13.21,61.16 14.02,61.98 19.91,61.98 LED2.A 20.73,62.59 21.54,63.4 29.26,63.4 30.07,62.59 LED1.A 30.89,62.59 33.53,65.23 80.06,65.23 80.87,64.41 IC5.15 | v40.84,35.76 v43.48,33.12
  Bottom 0.61: 76.81,3.86 76,3.86 IC7.32 | 76.81,3.86 77.42,3.86 C5.2 | IC7.30 75.79,8.33 76.81,7.32 76.81,3.86 | C4.2 44.5,26.82 45.92,26.82 IC2.20 | C6.2 57.1,3.86 54.46,3.86 IC4.28 52.43,4.27 50.8,5.89 50.8,10.16 45.92,10.16 45.11,10.97 45.11,25.6 44.5,26.21 C4.2 | IC1.7 18.9,36.98 20.32,36.98 C3.1 20.52,37.19 20.52,61.77 LED2.A | v14.43,36.58 14.43,33.33 13.41,32.31 RN1.1 | IC5.2 50.6,49.38 50.6,51.61 C8.1 49.99,52.43 49.78,52.63 49.78,61.98 49.38,62.38 49.38,64.82 48.97,65.23 30.68,65.23 30.68,62.79 LED1.A 30.68,61.77 31.7,60.76 31.7,57.3 34.75,54.25 34.75,48.97 39.62,44.09 39.62,41.25 39.83,41.05 IC6.3 40.23,40.23 40.23,37.19 C11.1 40.64,36.37 40.64,35.97 v40.84,35.76 | JP1.13 2.23,48.97 0.81,50.39 0.81,63.8 1.83,64.82 11.58,64.82 11.58,62.18 12.39,61.37 C7.1 | v43.48,33.12 43.48,27.03 C4.2
X1
  Top 0.203: IC1.39 34.14,49.78 36.17,51.82 38.81,51.82 Q1.1
  Bottom 0.203: C2.2 41.86,52.02 39.83,52.02 Q1.1
X2
  Top 0.203: IC1.38 34.14,47.14 38.81,47.14 Q1.2
  Bottom 0.203: C1.2 41.86,46.94 39.83,46.94 Q1.2

### Text on the board
bPlace: pugbutt.com 2022 | HD63C09 FUN V0.1
tDocu: /WR | PHI2 | /IRQ | D7 | D6 | D5 | D4 | D3 | D2 | D1 | D0 | /DSR | /DCD | VCC | /HALT | GND | X1 | GND | CS0 | /CS | /RES | RXC | XI | XO | /RTS | /CTS | TXD | /DTR | RXD | A0 | A1 | /NMI | X2 | /IRQ | /RES | /FIRQ | /MRDY | BS | QCLK | BA | ECLK | VCC | /BREQ | A0 | R//W | A1 | D0 | A2 | D1 | VCC | A3 | E | D2 | /RD | A4 | E | D3 | /WR | A5 | R/W | D4 | /A | A6 | A9 | D5 | /O | A7 | A10 | D6 | /U | A8 | A11 | D7 | L | A9 | A20 | A15 | /X | A10 | A21 | A14 | /N | A11 | A22 | A13 | A23 | A12 | G